# EAGLE design MA700 (EAGLE 6.5.0)
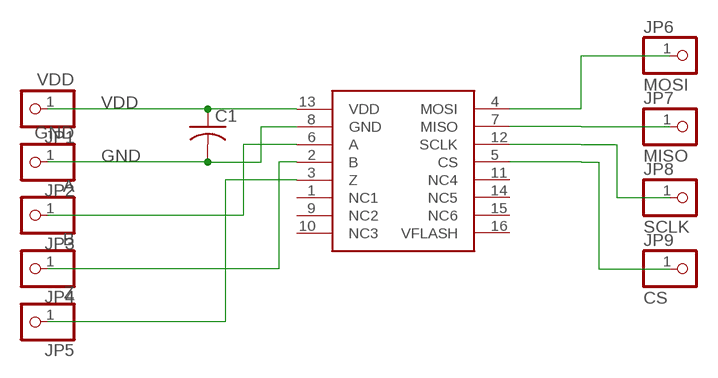
[diagram p0: schematic, sheet 1]

## Parts
C1  C-USC0603  [C0603]
JP1  VDD  PINHD-1X1  [1X01]
JP2  GND  PINHD-1X1  [1X01]
JP3  A  PINHD-1X1  [1X01]
JP4  B  PINHD-1X1  [1X01]
JP5  Z  PINHD-1X1  [1X01]
JP6  MOSI  PINHD-1X1  [1X01]
JP7  MISO  PINHD-1X1  [1X01]
JP8  SCLK  PINHD-1X1  [1X01]
JP9  CS  PINHD-1X1  [1X01]
U$1  MA700  [QFN16]

## Nets
GND: C1.2 JP2.1 U$1.8(GND)
N$1: JP4.1 U$1.2(B)
N$4: JP9.1 U$1.5(CS)
N$5: JP3.1 U$1.6(A)
N$9: JP5.1 U$1.3(Z)
N$12: JP7.1 U$1.7(MISO)
N$13: JP8.1 U$1.12(SCLK)
N$15: JP6.1 U$1.4(MOSI)
VDD: C1.1 JP1.1 U$1.13(VDD)
Unconnected: U$1.1(NC1) U$1.9(NC2) U$1.10(NC3) U$1.11(NC4) U$1.14(NC5) U$1.15(NC6) U$1.16(VFLASH)

## Library data of the parts
C1 = rcl:C-US: CAPACITOR, American symbol
JP1-JP9 = pinhead:PINHD-1X1: PIN HEADER
U$1 = BenLibrary:MA700

## Board
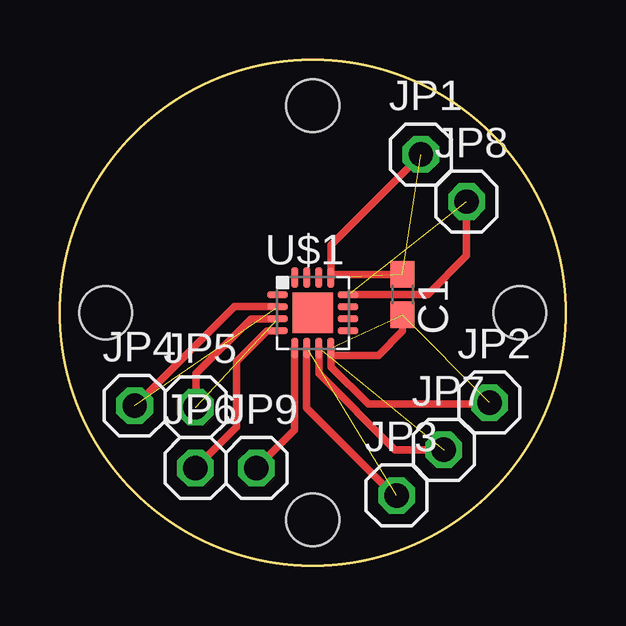
[diagram p1: board, top side]

Size 21.09 x 21.09 mm. Coordinates in mm from the lower left corner, seen from the top.
Outline: circle at 10.54,10.54 radius 10.54
Copper layers (1*16): Top 0.035mm / dielectric 1.5mm / Bottom 0.035mm
Design rules "default": minimum track width 10mil, minimum drill 24mil, track to track 8mil, track to pad 8mil, pad to pad 8mil, via to via 8mil, smd to smd 8mil, copper to edge 40mil, drill to drill 8mil, minimum pad ring 10mil, minimum via ring 8mil, stop-mask expansion 4mil, vias tented up to drill 0mil, thermal gap 10mil
Holes 2.2 mm at 10.54,19.18 19.18,10.54 10.54,1.91 1.91,10.54

### Footprints (pad centres in the part's own frame; a part is rotated, then mirrored left to right if it is on the bottom)
C0603 = smd 1.1 x 1: 1 -0.85,0; 2 0.85,0
1X01 = drill 1.016 octagon: 1 0,0
QFN16 = smd 0.85 x 0.3: 1 -1.475,0.75; 2 -1.475,0.25; 3 -1.475,-0.25; 4 -1.475,-0.75; 9 1.475,-0.75; 10 1.475,-0.25; 11 1.475,0.25; 12 1.475,0.75 | smd 0.3 x 0.85: 5 -0.75,-1.475; 6 -0.25,-1.475; 7 0.25,-1.475; 8 0.75,-1.475; 13 0.75,1.475; 14 0.25,1.475; 15 -0.25,1.475; 16 -0.75,1.475 | smd 1.7 x 1.7: TH 0,0

### Placement (x,y rotation side)
C1  14.29,11.3 270 top
JP1  15.05,17.15 0 top
JP2  17.91,6.8 0 top
JP3  14.04,2.92 0 top
JP4  3.11,6.67 0 top
JP5  5.65,6.61 0 top
JP6  5.65,4.07 0 top
JP7  16,4.83 0 top
JP8  16.96,15.18 0 top
JP9  8.19,4.07 0 top
U$1  10.54,10.54 0 top

### Tracks (layer width: path | path; a pad name or v marks a point on that pad's centre or on a via)
GND  (2 unrouted)
N$1  (1 unrouted)
N$4  (1 unrouted)
  Top 0.305: 9.78,9.05 9.78,5.65 JP9.1
N$5  (1 unrouted)
N$6
  Top 0.305: 9.08,10.8 7.27,10.8 3.08,6.61
N$9  (1 unrouted)
N$10
  Top 0.305: 9.08,10.29 7.97,10.29 5.68,8 5.68,6.61
N$12  (1 unrouted)
N$13  (1 unrouted)
N$15  (1 unrouted)
  Top 0.305: 9.05,9.78 8.64,9.78 7.37,8.51 7.37,5.78 JP6.1
N$16
  Top 0.305: 10.29,9.08 10.29,6.57 14.04,2.83
N$17
  Top 0.305: 10.8,9.05 10.8,8 13.97,4.83 15.97,4.83 16,4.86
N$18
  Top 0.305: 11.3,12 11.3,12.13 | 11.3,12.13 11.3,13.37 15.08,17.15 | 14.26,12.13 11.3,12.13
N$19
  Top 0.305: 12.03,11.31 15.34,11.31 16.96,12.92 16.96,15.18 16.99,15.21
N$21
  Top 0.305: 14.29,10.45 14.29,9.78 13.27,8.76 11.3,8.76 | 11.3,9.05 11.3,8.76 | 11.3,8.76 11.3,8.29 12.86,6.73 18,6.73 18.04,6.76
VDD  (2 unrouted)